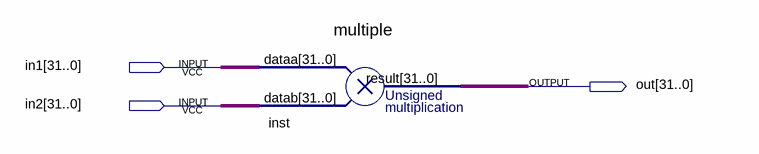
[diagram p0: schematic sheet]
// Quartus schematic mul.bdf as structural Verilog: 1 symbols, 3 pins
module mul (
  input  [31:0] in1,
  input  [31:0] in2,
  output [31:0] out
);

  multiple inst (.dataa(in1), .datab(in2), .result(out));
endmodule
